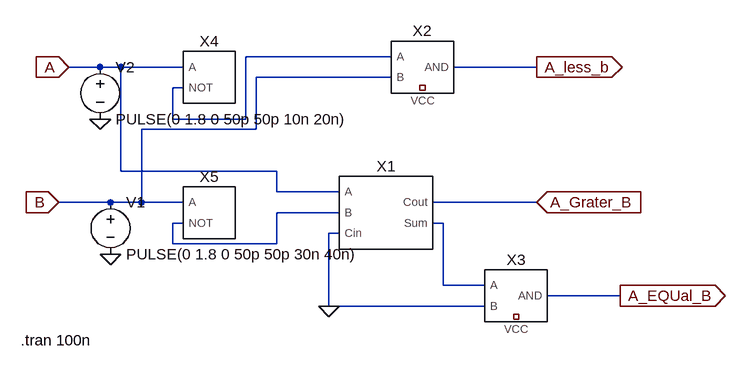
[diagram p0: schematic comparator.asc]
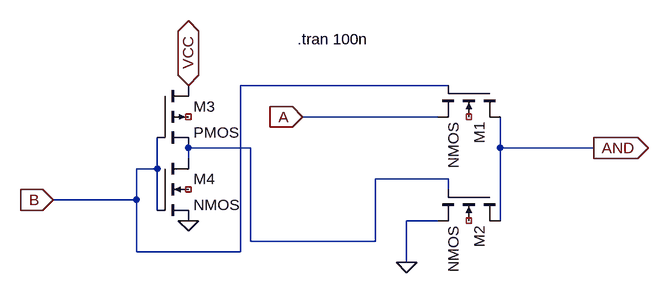
[diagram p1: sub-circuit andpass.asc]
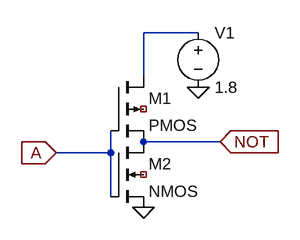
[diagram p2: sub-circuit notagin.asc]
comparator.asc, the LTspice schematic file:
Version 4
SHEET 1 880 680
WIRE 288 -64 64 -64
WIRE -160 -48 -208 -48
WIRE -128 -48 -160 -48
WIRE -32 -48 -128 -48
WIRE 512 -48 384 -48
WIRE 288 -32 80 -32
WIRE -32 -16 -48 -16
WIRE -48 32 -48 -16
WIRE 64 32 64 -64
WIRE 64 32 -48 32
WIRE 80 48 80 -32
WIRE 80 48 -96 48
WIRE -128 112 -128 -48
WIRE 112 112 -128 112
WIRE 112 144 112 112
WIRE 208 144 112 144
WIRE -144 160 -224 160
WIRE -96 160 -96 48
WIRE -96 160 -144 160
WIRE -32 160 -96 160
WIRE 512 160 352 160
WIRE 208 176 112 176
WIRE -32 192 -48 192
WIRE 368 192 352 192
WIRE 208 208 192 208
WIRE -48 224 -48 192
WIRE 112 224 112 176
WIRE 112 224 -48 224
WIRE 368 288 368 192
WIRE 432 288 368 288
WIRE 640 304 528 304
WIRE 192 320 192 208
WIRE 432 320 192 320
FLAG 192 320 0
FLAG -208 -48 A
IOPIN -208 -48 In
FLAG -224 160 B
IOPIN -224 160 In
FLAG 512 -48 A_less_b
IOPIN 512 -48 Out
FLAG 512 160 A_Grater_B
IOPIN 512 160 In
FLAG 640 304 A_EQUal_B
IOPIN 640 304 Out
FLAG -160 32 0
FLAG -144 240 0
SYMBOL FullAdderpass 272 176 R0
SYMATTR InstName X1
SYMBOL andpass 336 -48 R0
SYMATTR InstName X2
SYMBOL andpass 480 304 R0
SYMATTR InstName X3
SYMBOL NOTagin 0 -32 R0
SYMATTR InstName X4
SYMBOL NOTagin 0 176 R0
SYMATTR InstName X5
SYMBOL voltage -144 144 R0
WINDOW 123 0 0 Left 0
WINDOW 39 0 0 Left 0
SYMATTR InstName V1
SYMATTR Value PULSE(0 1.8 0 50p 50p 30n 40n)
SYMBOL voltage -160 -64 R0
WINDOW 123 0 0 Left 0
WINDOW 39 0 0 Left 0
SYMATTR InstName V2
SYMATTR Value PULSE(0 1.8 0 50p 50p 10n 20n)
TEXT -282 372 Left 2 !.tran 100n

andpass.asc, the sub-circuit schematic file:
Version 4
SHEET 1 880 680
WIRE 480 48 160 48
WIRE 464 96 256 96
WIRE 176 144 80 144
WIRE 560 144 560 96
WIRE 704 144 560 144
WIRE 80 160 80 144
WIRE 32 176 32 128
WIRE 32 176 0 176
WIRE 480 192 368 192
WIRE 480 208 480 192
WIRE 0 224 0 176
WIRE 0 224 -128 224
WIRE 32 240 32 176
WIRE 464 256 416 256
WIRE 560 256 560 144
WIRE 176 288 176 144
WIRE 368 288 368 192
WIRE 368 288 176 288
WIRE 0 304 0 224
WIRE 160 304 160 48
WIRE 160 304 0 304
WIRE 416 320 416 256
FLAG 416 320 0
FLAG 704 144 AND
IOPIN 704 144 Out
FLAG 256 96 A
IOPIN 256 96 In
FLAG -128 224 B
IOPIN -128 224 In
FLAG 80 256 0
FLAG 80 48 VCC
IOPIN 80 48 BiDir
SYMBOL nmos4 560 48 R90
SYMATTR InstName M1
SYMBOL nmos4 560 208 R90
SYMATTR InstName M2
SYMBOL pmos4 32 48 R0
SYMATTR InstName M3
SYMBOL nmos4 32 160 R0
SYMATTR InstName M4
TEXT 248 -24 Left 2 !.tran 100n

notagin.asc, the sub-circuit schematic file:
Version 4
SHEET 1 880 680
WIRE 272 -32 192 -32
WIRE 192 32 192 -32
WIRE 304 128 192 128
WIRE 144 144 144 112
WIRE 144 144 64 144
WIRE 144 208 144 144
FLAG 192 224 0
FLAG 64 144 A
IOPIN 64 144 In
FLAG 304 128 NOT
IOPIN 304 128 In
FLAG 272 48 0
SYMBOL pmos4 144 32 R0
SYMATTR InstName M1
SYMBOL nmos4 144 128 R0
SYMATTR InstName M2
SYMBOL voltage 272 -48 R0
WINDOW 123 0 0 Left 0
WINDOW 39 0 0 Left 0
SYMATTR InstName V1
SYMATTR Value 1.8

The netlist it stands for:
* comparator.asc
XX1 A N002 0 A_Grater_B N003 FullAdderpass  ; pins A B Cin Cout Sum
XX2 N001 B A_less_b NC_01 andpass
XX3 N003 0 A_EQUal_B NC_02 andpass
XX4 A N001 notagin
XX5 B N002 notagin
V1 B 0 PULSE(0 1.8 0 50p 50p 30n 40n)
V2 A 0 PULSE(0 1.8 0 50p 50p 10n 20n)

* block symbol definitions
.subckt andpass A B AND VCC
M1 AND B A NC_01 NMOS
M2 AND N001 0 NC_02 NMOS
M3 VCC B N001 NC_03 PMOS
M4 N001 B 0 NC_04 NMOS
.tran 100n
.ends andpass

.subckt notagin A NOT
M1 N001 A NOT NC_01 PMOS
M2 NOT A 0 NC_02 NMOS
V1 N001 0 1.8
.ends notagin

.model NMOS NMOS
.model PMOS PMOS
.lib standard.mos
.tran 100n
.backanno
.end